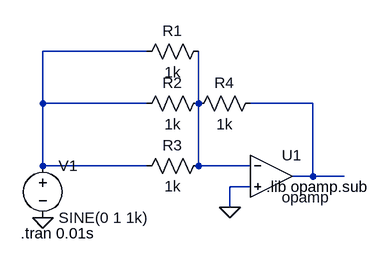
[diagram p0: schematic week2_20a.asc]
week2_20a.asc, the LTspice schematic file:
Version 4
SHEET 1 880 872
WIRE 64 576 -96 576
WIRE -96 656 -96 576
WIRE 64 656 -96 656
WIRE 144 656 144 576
WIRE 320 656 224 656
WIRE -96 752 -96 656
WIRE 64 752 -96 752
WIRE 144 752 144 656
WIRE 224 752 144 752
WIRE 320 768 320 656
WIRE 320 768 288 768
WIRE 368 768 320 768
WIRE 224 784 192 784
WIRE 192 816 192 784
FLAG 192 816 0
FLAG -96 832 0
SYMBOL res 160 560 R90
WINDOW 0 0 56 VBottom 2
WINDOW 3 32 56 VTop 2
SYMATTR InstName R1
SYMATTR Value 1k
SYMBOL res 160 640 R90
WINDOW 0 0 56 VBottom 2
WINDOW 3 32 56 VTop 2
SYMATTR InstName R2
SYMATTR Value 1k
SYMBOL res 160 736 R90
WINDOW 0 0 56 VBottom 2
WINDOW 3 32 56 VTop 2
SYMATTR InstName R3
SYMATTR Value 1k
SYMBOL res 240 640 R90
WINDOW 0 0 56 VBottom 2
WINDOW 3 32 56 VTop 2
SYMATTR InstName R4
SYMATTR Value 1k
SYMBOL OpAmps\\opamp 256 704 R0
SYMATTR InstName U1
SYMBOL voltage -96 736 R0
WINDOW 123 0 0 Left 0
WINDOW 39 0 0 Left 0
SYMATTR InstName V1
SYMATTR Value SINE(0 1 1k)
TEXT -130 856 Left 2 !.tran 0.01s
TEXT 248 784 Left 2 !.lib opamp.sub

The netlist it stands for:
* week2_20a.asc
R1 N002 N001 1k
R2 N002 N001 1k
R3 N002 N001 1k
R4 N003 N002 1k
XU1 N002 0 N003 opamp Aol=100K GBW=10Meg  ; pins invin noninvin out
V1 N001 0 SINE(0 1 1k)
.tran 0.01s
.lib opamp.sub
.backanno
.end